# Altium schematic sheet LCDTFT_FPC30P_LVDS.SchDoc
size A3
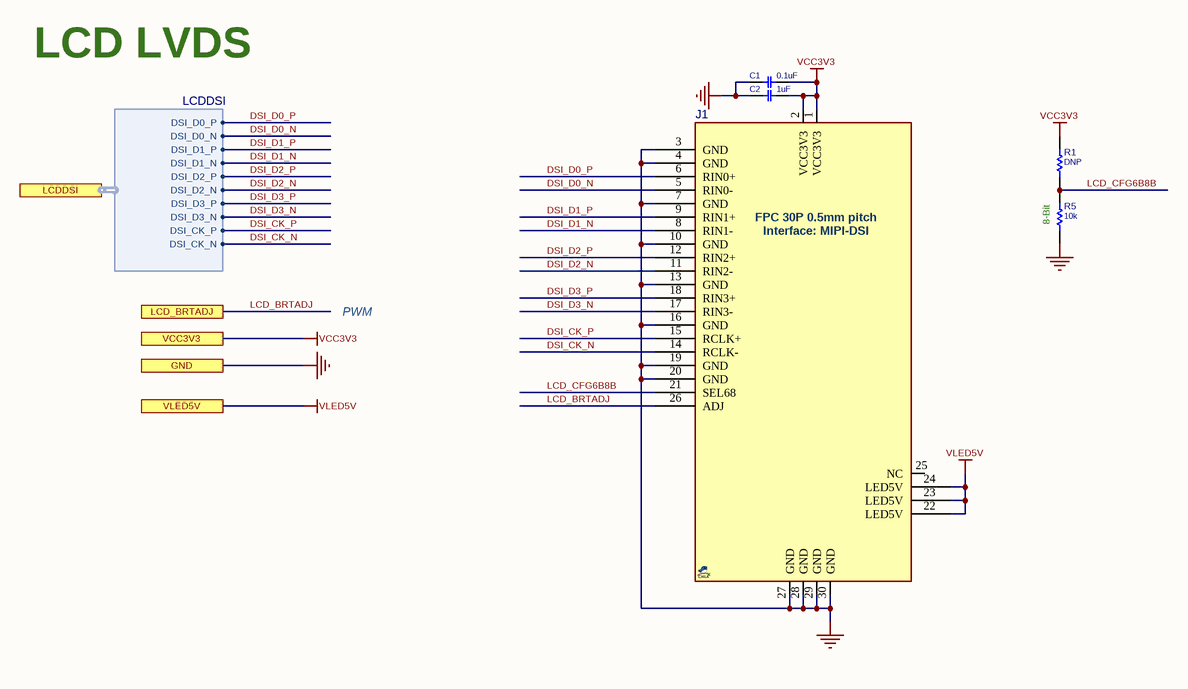
[diagram p0: LCDTFT_FPC30P_LVDS.SchDoc]

## Parts
C1  0.1uF  [C0402]
C2  1uF  [C0402]
J1  FPC_30_0.5mm  [FPC50_30]  (value not drawn)
R1  DNP  [R0402]
R5  10k  [R0402]

## Ports
GND, LCD_BRTADJ, LCDDSI (harness LCDDSI), VCC3V3, VLED5V

## Harnesses
LCDDSI: DSI_D0_P, DSI_D0_N, DSI_D1_P, DSI_D1_N, DSI_D2_P, DSI_D2_N, DSI_D3_P, DSI_D3_N, DSI_CK_P, DSI_CK_N

## Nets
GND: C1.2 C2.2 J1.3(GND) J1.4(GND) J1.7(GND) J1.10(GND) J1.13(GND) J1.16(GND) J1.19(GND) J1.20(GND) J1.27(GND) J1.28(GND) J1.29(GND) J1.30(GND) R5.2 ; port GND
VCC3V3: C1.1 C2.1 J1.1(VCC3V3) J1.2(VCC3V3) R1.1 ; port VCC3V3
VLED5V: J1.22(LED5V) J1.23(LED5V) J1.24(LED5V) ; port VLED5V
DSI_CK_N: J1.14(RCLK-) ; port LCDDSI.DSI_CK_N
DSI_CK_P: J1.15(RCLK+) ; port LCDDSI.DSI_CK_P
DSI_D0_N: J1.5(RIN0-) ; port LCDDSI.DSI_D0_N
DSI_D0_P: J1.6(RIN0+) ; port LCDDSI.DSI_D0_P
DSI_D1_N: J1.8(RIN1-) ; port LCDDSI.DSI_D1_N
DSI_D1_P: J1.9(RIN1+) ; port LCDDSI.DSI_D1_P
DSI_D2_N: J1.11(RIN2-) ; port LCDDSI.DSI_D2_N
DSI_D2_P: J1.12(RIN2+) ; port LCDDSI.DSI_D2_P
DSI_D3_N: J1.17(RIN3-) ; port LCDDSI.DSI_D3_N
DSI_D3_P: J1.18(RIN3+) ; port LCDDSI.DSI_D3_P
LCD_BRTADJ: J1.26(ADJ) ; port LCD_BRTADJ
LCD_CFG6B8B: J1.21(SEL68) R1.2 R5.1

Not connected (* = marked no-connect by the designer): J1 25(NC)

## Notes on the sheet
- LCD LVDS
- (near R5) 8-Bit
- PWM
- (in symbol LCDTFT_DSI_FPC30P) FPC 30P 0.5mm pitch; Interface: MIPI-DSI

## Library data of the parts
C1 = CAP_SMD_MLCC: CAP, MLCC; PARAM: X7R, 10%, -55~125oC; MANF_P#: GRM155R71H104KE14D; MANF: Murata; PARAM2: 50v; PRICE: 100: 0.018$; ASSEMBLY: ASSEMBLY; VALUE: 0.1uF
C2 = CAP_SMD_MLCC: CAP, MLCC; PARAM: X5R, 10%; MANF_P#: CL05A105KO5NNND; MANF: Samsung; PARAM2: 16v; PRICE: 50,000:	$0.006; ASSEMBLY: ASSEMBLY; VALUE: 1uF
J1 = LCDTFT_DSI_FPC30P: LCD TFT Color, FPC30P, LVDS; MANF: -; MANF_P#: -; PARAM: -; VALUE: FPC_30_0.5mm
R1 R5 = RES_SMD: RESISTOR, SMD; PARAM: 0.063W; DESC: DESCRIPTION; DIST#: MOUSER; PARAM2: 1%; MANF_P#: -; MANF: -; ASSEMBLY: ASSEMBLY; PRICE: 100= 0.3$
  R1: VALUE: DNP
  R5: VALUE: 10k